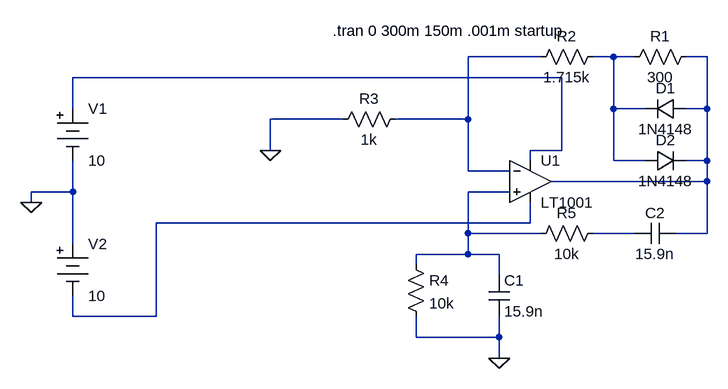
[diagram p0: schematic wien5.asc]
wien5.asc, the LTspice schematic file:
Version 4
SHEET 1 880 680
WIRE 160 -48 48 -48
WIRE 272 -48 240 -48
WIRE 304 -48 272 -48
WIRE 416 -48 384 -48
WIRE 192 -16 -560 -16
WIRE -560 32 -560 -16
WIRE 272 32 272 -48
WIRE 320 32 272 32
WIRE 416 32 416 -48
WIRE 416 32 384 32
WIRE -144 48 -256 48
WIRE 48 48 48 -48
WIRE 48 48 -64 48
WIRE -256 96 -256 48
WIRE 192 96 192 -16
WIRE 192 96 144 96
WIRE 144 112 144 96
WIRE 272 112 272 32
WIRE 320 112 272 112
WIRE 416 112 416 32
WIRE 416 112 384 112
WIRE 48 128 48 48
WIRE 112 128 48 128
WIRE 416 144 416 112
WIRE 416 144 176 144
WIRE -560 160 -560 112
WIRE -560 160 -624 160
WIRE 112 160 48 160
WIRE -624 176 -624 160
WIRE 144 208 144 176
WIRE 144 208 -432 208
WIRE 48 224 48 160
WIRE 160 224 48 224
WIRE 304 224 240 224
WIRE 416 224 416 144
WIRE 416 224 368 224
WIRE -560 240 -560 160
WIRE 48 256 48 224
WIRE 48 256 -32 256
WIRE 96 256 48 256
WIRE -32 272 -32 256
WIRE 96 288 96 256
WIRE -560 352 -560 320
WIRE -432 352 -432 208
WIRE -432 352 -560 352
WIRE -32 384 -32 352
WIRE 96 384 96 352
WIRE 96 384 -32 384
WIRE 96 416 96 384
FLAG -256 96 0
FLAG 96 416 0
FLAG -624 176 0
SYMBOL Opamps\\LT1001 144 80 R0
SYMATTR InstName U1
SYMBOL res 256 -64 R90
WINDOW 0 0 56 VBottom 2
WINDOW 3 32 56 VTop 2
SYMATTR InstName R2
SYMATTR Value 1.715k
SYMBOL res -48 32 R90
WINDOW 0 0 56 VBottom 2
WINDOW 3 32 56 VTop 2
SYMATTR InstName R3
SYMATTR Value 1k
SYMBOL cap 80 288 R0
SYMATTR InstName C1
SYMATTR Value 15.9n
SYMBOL res 256 208 R90
WINDOW 0 0 56 VBottom 2
WINDOW 3 32 56 VTop 2
SYMATTR InstName R5
SYMATTR Value 10k
SYMBOL cap 368 208 R90
WINDOW 0 0 32 VBottom 2
WINDOW 3 32 32 VTop 2
SYMATTR InstName C2
SYMATTR Value 15.9n
SYMBOL res -48 256 R0
SYMATTR InstName R4
SYMATTR Value 10k
SYMBOL Misc\\battery -560 16 R0
WINDOW 123 0 0 Left 2
WINDOW 39 0 0 Left 2
SYMATTR InstName V1
SYMATTR Value 10
SYMBOL Misc\\battery -560 224 R0
WINDOW 123 0 0 Left 2
WINDOW 39 0 0 Left 2
SYMATTR InstName V2
SYMATTR Value 10
SYMBOL res 400 -64 R90
WINDOW 0 0 56 VBottom 2
WINDOW 3 32 56 VTop 2
SYMATTR InstName R1
SYMATTR Value 300
SYMBOL diode 384 16 R90
WINDOW 0 0 32 VBottom 2
WINDOW 3 32 32 VTop 2
SYMATTR InstName D1
SYMATTR Value 1N4148
SYMBOL diode 320 128 R270
WINDOW 0 32 32 VTop 2
WINDOW 3 0 32 VBottom 2
SYMATTR InstName D2
SYMATTR Value 1N4148
TEXT -160 -88 Left 2 !.tran 0 300m 150m .001m startup

The netlist it stands for:
* wien5.asc
XU1 N005 N001 N004 N006 N003 LT1001  ; pins In+ In- V+ V- OUT
R2 N002 N001 1.715k
R3 N001 0 1k
C1 N005 0 15.9n
R5 N007 N005 10k
C2 N003 N007 15.9n
R4 N005 0 10k
V1 N004 0 10
V2 0 N006 10
R1 N003 N002 300
D1 N003 N002 1N4148
D2 N002 N003 1N4148
.model D D
.lib standard.dio
.tran 0 300m 150m .001m startup
.lib LTC.lib
.backanno
.end